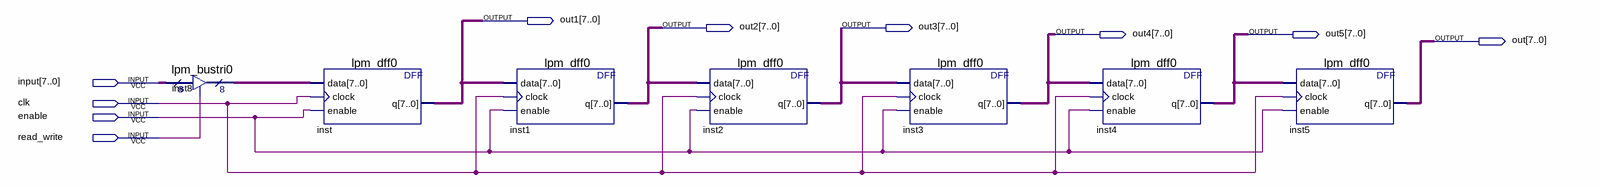
[diagram p0: schematic sheet]
// Quartus schematic buffer.bdf as structural Verilog: 7 symbols, 10 pins
module buffer (
  input  [7:0] \input ,
  input  clk,
  input  enable,
  input  read_write,
  output [7:0] out1,
  output [7:0] out2,
  output [7:0] out3,
  output [7:0] out4,
  output [7:0] out5,
  output [7:0] out
);

  wire [7:0] inst8_tridata;

  lpm_bustri0 inst8 (.enabledt(read_write), .data(\input ), .tridata(inst8_tridata));
  lpm_dff0 inst (.data(inst8_tridata), .clock(clk), .enable(enable), .q(out1));
  lpm_dff0 inst1 (.data(out1), .clock(clk), .enable(enable), .q(out2));
  lpm_dff0 inst2 (.data(out2), .clock(clk), .enable(enable), .q(out3));
  lpm_dff0 inst3 (.data(out3), .clock(clk), .enable(enable), .q(out4));
  lpm_dff0 inst4 (.data(out4), .clock(clk), .enable(enable), .q(out5));
  lpm_dff0 inst5 (.data(out5), .clock(clk), .enable(enable), .q(out));
endmodule
